# Altium schematic sheet Node MCU_Schematics I2C Pinout v3.02_2022-01-05.schdoc
size 271 x 172 mm
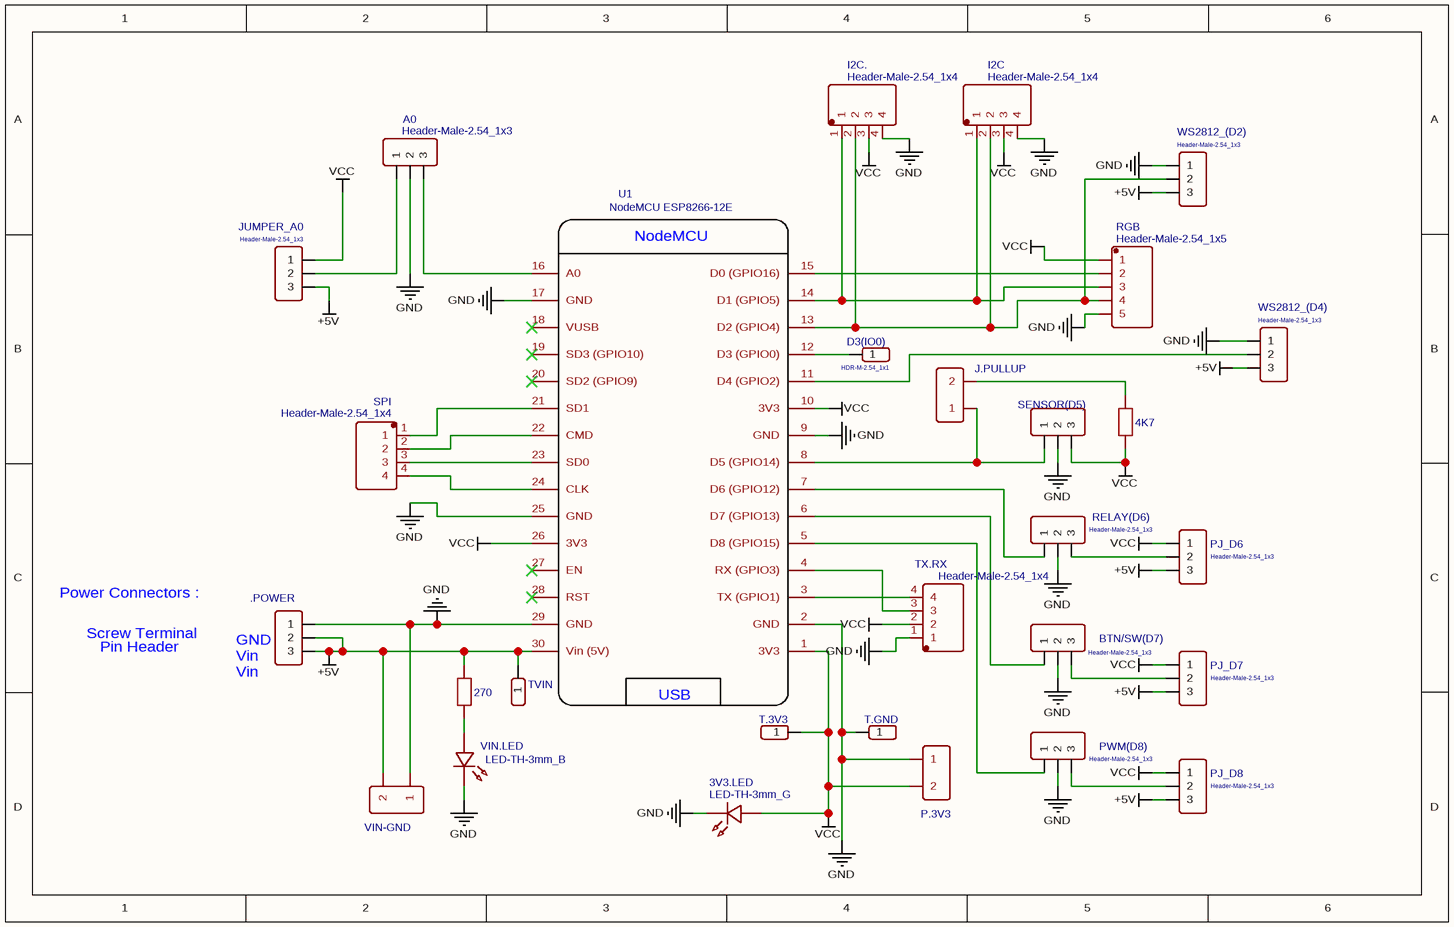
[diagram p0: Node MCU_Schematics I2C Pinout v3.02_2022-01-05.schdoc]

## Parts
3V3.LED  LED-TH-3mm_G  [LED-TH_BD3.0_GREEN]
4K7  4k7  [AXIAL-0.3]  (value not drawn)
270  4k7  [AXIAL-0.3]  (value not drawn)
.POWER  Header-Male-2.54_1x3  [HDR-TH_3P-P2.54-V]  (value not drawn)
A0  Header-Male-2.54_1x3  [HDR-TH_3P-P2.54-V]
BTN/SW(D7)  Header-Male-2.54_1x3  [HDR-TH_3P-P2.54-V]
D3(IO0)  HDR-M-2.54_1x1  [HDR-M-2.54_1X1]
I2C  Header-Male-2.54_1x4  [DIP-1X4P-2.54MM-M]
I2C.  Header-Male-2.54_1x4  [DIP-1X4P-2.54MM-M]
J.PULLUP  Header-Male-2.54_1x2  [HDR-2X1/2.54]  (value not drawn)
JUMPER_A0  Header-Male-2.54_1x3  [HDR-TH_3P-P2.54-V]
P.3V3  Header-Male-2.54_1x2  [HDR-2X1/2.54]  (value not drawn)
PJ_D6  Header-Male-2.54_1x3  [HDR-TH_3P-P2.54-V]
PJ_D7  Header-Male-2.54_1x3  [HDR-TH_3P-P2.54-V]
PJ_D8  Header-Male-2.54_1x3  [HDR-TH_3P-P2.54-V]
PWM(D8)  Header-Male-2.54_1x3  [HDR-TH_3P-P2.54-V]
RELAY(D6)  Header-Male-2.54_1x3  [HDR-TH_3P-P2.54-V]
RGB  Header-Male-2.54_1x5  [DIP-1X5P-2.54MM-M]
SENSOR(D5)  Header-Male-2.54_1x3  [HDR-TH_3P-P2.54-V]  (value not drawn)
SPI  Header-Male-2.54_1x4  [DIP-1X4P-2.54MM-M]
T.3V3  Header-Male-2.54_1x1  [HDR-1X1/2.54]  (value not drawn)
T.GND  Header-Male-2.54_1x1  [HDR-1X1/2.54]  (value not drawn)
TVIN  TVin  [HDR-1X1/2.54]  (value not drawn)
TX.RX  Header-Male-2.54_1x4  [DIP-1X4P-2.54MM-M]
U1  NodeMCU ESP8266-12E  [NODEMCU]
VIN-GND  Header-Male-2.54_1x2  [HDR-2X1/2.54]  (value not drawn)
VIN.LED  LED-TH-3mm_B  [LED-TH_BD3.0_BLUE]
WS2812_(D2)  Header-Male-2.54_1x3  [HDR-TH_3P-P2.54-V]
WS2812_(D4)  Header-Male-2.54_1x3  [HDR-TH_3P-P2.54-V]

## Nets
+5V: 270.2 .POWER.2 .POWER.3 JUMPER_A0.3 PJ_D6.3 PJ_D7.3 PJ_D8.3 TVIN.1 U1.30(Vin_(5V)) VIN-GND.2 WS2812_(D2).3 WS2812_(D4).3
GND: 3V3.LED.2 .POWER.1 A0.2 BTN/SW(D7).2 I2C.4 I2C..4 P.3V3.1 PWM(D8).2 RELAY(D6).2 RGB.5 SENSOR(D5).2 T.GND.1 TX.RX.1 U1.2(GND) U1.9(GND) U1.17(GND) U1.25(GND) U1.29(GND) VIN-GND.1 VIN.LED.2 WS2812_(D2).1 WS2812_(D4).1
VCC: 3V3.LED.1 4K7.1 I2C.3 I2C..3 JUMPER_A0.1 P.3V3.2 PJ_D6.1 PJ_D7.1 PJ_D8.1 RGB.1 SENSOR(D5).3 T.3V3.1 TX.RX.2 U1.1(3V3) U1.10(3V3) U1.26(3V3)
Net4K7_2: 4K7.2 J.PULLUP.2
Net270_1: 270.1 VIN.LED.1
NetA0_1: A0.1 JUMPER_A0.2
NetA0_3: A0.3 U1.16(A0)
NetBTN/SW(D7)_1: BTN/SW(D7).1 U1.6(D7_(GPIO13))
NetBTN/SW(D7)_3: BTN/SW(D7).3 PJ_D7.2
NetD3(IO0)_1: D3(IO0).1 U1.12(D3_(GPIO0))
NetI2C_1: I2C.1 I2C..1 RGB.3 U1.14(D1_(GPIO5))
NetI2C_2: I2C.2 I2C..2 RGB.4 U1.13(D2_(GPIO4)) WS2812_(D2).2
NetJ.PULLUP_1: J.PULLUP.1 SENSOR(D5).1 U1.8(D5_(GPIO14))
NetPJ_D6_2: PJ_D6.2 RELAY(D6).3
NetPJ_D8_2: PJ_D8.2 PWM(D8).3
NetPWM(D8)_1: PWM(D8).1 U1.5(D8_(GPIO15))
NetRELAY(D6)_1: RELAY(D6).1 U1.7(D6_(GPIO12))
NetRGB_2: RGB.2 U1.15(D0_(GPIO16))
NetSPI_1: SPI.1 U1.21(SD1)
NetSPI_2: SPI.2 U1.22(CMD)
NetSPI_3: SPI.3 U1.23(SD0)
NetSPI_4: SPI.4 U1.24(CLK)
NetTX.RX_3: TX.RX.3 U1.4(RX_(GPIO3))
NetTX.RX_4: TX.RX.4 U1.3(TX_(GPIO1))
NetU1_11: U1.11(D4_(GPIO2)) WS2812_(D4).2

Not connected (* = marked no-connect by the designer): U1 18(VUSB)* 19(SD3_(GPIO10))* 20(SD2_(GPIO9))* 27(EN)* 28(RST)*

## Notes on the sheet
- Power Connectors :
- Screw Terminal
- Pin Header
- (near .POWER) GND
  Vin
  Vin
- (in symbol NodeMCU ESP8266-12E) NodeMCU; USB

## Library data of the parts
3V3.LED = LED-TH-3mm_G: BOM_Manufacturer: EVERLIGHT(台湾亿光); BOM_Manufacturer Part: 204-10SYGD/S530-E3; Contributor: LCEDA_Lib; BOM_Supplier Part: C85161; spicePre: L; spiceSymbolName: LED-TH-3mm_G
4K7 270 = 4k7: nameAlias: Value(Ω); spicePre: R; spiceSymbolName: Res_AXIAL-0.3(1/8W)_EU
.POWER A0 BTN/SW(D7) JUMPER_A0 PJ_D6-PJ_D8 PWM(D8) RELAY(D6) SENSOR(D5) WS2812_(D2) WS2812_(D4) = Header-Male-2.54_1x3: BOM_Manufacturer: BOOMELE; BOM_Manufacturer Part: Header2.54mm 1*3P; BOM_Supplier: LCSC; image: //image.lceda.cn/szlcsc/C49257.jpg; BOM_Supplier Part: C49257; spicePre: H; spiceSymbolName: Header-Male-2.54_1x3
D3(IO0) = HDR-M-2.54_1x1: Contributor: LCEDA_Lib; BOM_Supplier Part: C81276; BOM_Supplier: LCSC; spicePre: J; spiceSymbolName: HDR-M-2.54_1x1
I2C I2C. SPI TX.RX = Header-Male-2.54_1x4: BOM_Manufacturer: Ckmtw; BOM_Manufacturer Part: 210S-1*4P L=11.6MMGold-plated black; Contributor: LCSC; BOM_Supplier: LCSC; BOM_Supplier Part: C124378; spicePre: H; spiceSymbolName: Header-Male-2.54_1x4
J.PULLUP P.3V3 VIN-GND = Header-Male-2.54_1x2: BOM_Manufacturer: TE Connectivity; BOM_Manufacturer Part: 826629-2; BOM_Supplier: LCSC; image: //image.lceda.cn/szlcsc/C86471.jpg; BOM_Supplier Part: C86471; spicePre: H; spiceSymbolName: Header-Male-2.54_1x2
RGB = Header-Male-2.54_1x5: BOM_Manufacturer: Ckmtw; BOM_Manufacturer Part: 210S-1*5P L=11.6MMGold-plated black; Contributor: LCSC; BOM_Supplier: LCSC; BOM_Supplier Part: C124379; spicePre: H; spiceSymbolName: Header-Male-2.54_1x5
T.3V3 T.GND = Header-Male-2.54_1x1: BOM_Manufacturer: ReliaPro; BOM_Supplier: LCSC; BOM_Manufacturer Part: Header-Male-2.54_1x1; BOM_Supplier Part: C81276; spicePre: P; spiceSymbolName: Header-Male-2.54_1x1
TVIN = TVin: BOM_Manufacturer: ReliaPro; BOM_Manufacturer Part: Header-Male-2.54_1x1; BOM_Supplier: LCSC; BOM_Supplier Part: C81276; spicePre: P; spiceSymbolName: Header-Male-2.54_1x1
U1 = NodeMCU ESP8266-12E: Contributor: irukard; sourceId: c4ASM4mEW; Author: Krzysztof Daszuta; timeStamp: 1474282571; BOM_Supplier: Nettigo; BOM_Manufacturer Part: ?; spicePre: U; BOM_Supplier Part: nodemcu-v2
VIN.LED = LED-TH-3mm_B: BOM_Manufacturer: EVERLIGHT(台湾亿光); BOM_Manufacturer Part: 204-10SUBC/S400-A4; Contributor: LCEDA_Lib; BOM_Supplier Part: C86881; BOM_Supplier: LCSC; spicePre: L; spiceSymbolName: LED-TH-3mm_B